# EAGLE design pla251715 (EAGLE 6.3)
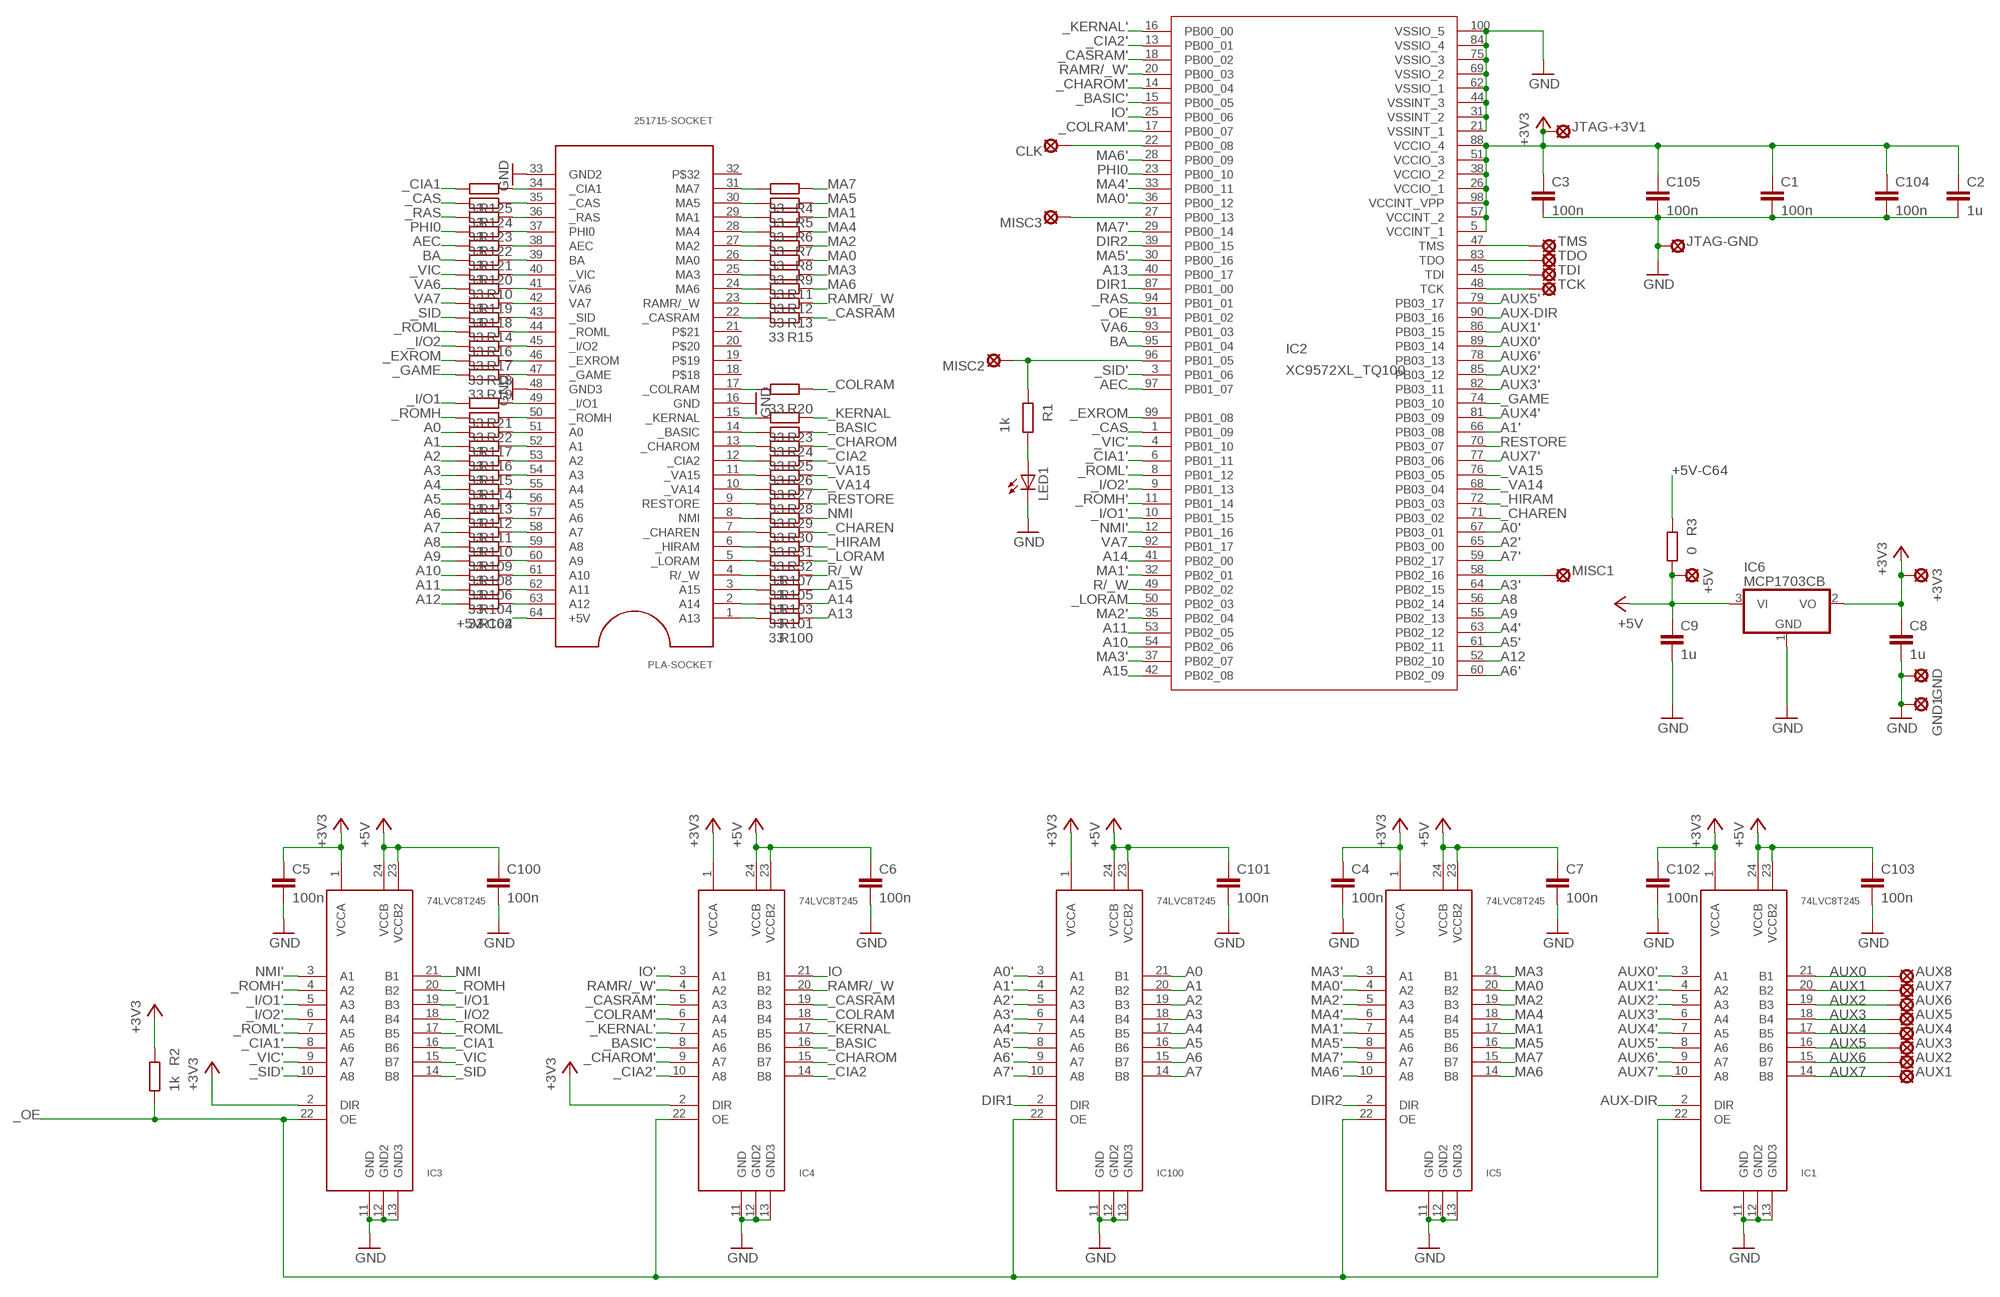
[diagram p0: schematic, sheet 1]

## Parts
+3V3  LSP10  [LSP10]
+5V  LSP10  [LSP10]
AUX1  LSP10  [LSP10]
AUX2  LSP10  [LSP10]
AUX3  LSP10  [LSP10]
AUX4  LSP10  [LSP10]
AUX5  LSP10  [LSP10]
AUX6  LSP10  [LSP10]
AUX7  LSP10  [LSP10]
AUX8  LSP10  [LSP10]
C1  100n  C-EUC0603  [C0603]
C2  1u  C-EUC1210  [C1210]
C3  100n  C-EUC0603  [C0603]
C4  100n  C-EUC0603  [C0603]
C5  100n  C-EUC0603  [C0603]
C6  100n  C-EUC0603  [C0603]
C7  100n  C-EUC0603  [C0603]
C8  1u  C-EUC1210  [C1210]
C9  1u  C-EUC1210  [C1210]
C100  100n  C-EUC0603  [C0603]
C101  100n  C-EUC0603  [C0603]
C102  100n  C-EUC0603  [C0603]
C103  100n  C-EUC0603  [C0603]
C104  100n  C-EUC0603  [C0603]
C105  100n  C-EUC0603  [C0603]
CLK  LSP10  [LSP10]
GND  LSP10  [LSP10]
GND1  LSP10  [LSP10]
IC1  74LVC8T245  [TSSOP24]
IC2  XC9572XL_TQ100  [TQ100]
IC3  74LVC8T245  [TSSOP24]
IC4  74LVC8T245  [TSSOP24]
IC5  74LVC8T245  [TSSOP24]
IC6  MCP1703CB  [SOT23]
IC100  74LVC8T245  [TSSOP24]
JTAG-+3V1  LSP10  [LSP10]
JTAG-GND  LSP10  [LSP10]
LED1  LED5MM  [LED5MM]
MISC1  LSP10  [LSP10]
MISC2  LSP10  [LSP10]
MISC3  LSP10  [LSP10]
PLA-SOCKET  251715-SOCKET  [64-SPDIP]
R1  1k  R-EU_R0805  [R0805]
R2  1k  R-EU_R0805  [R0805]
R3  0  R-EU_R0805  [R0805]
R4  33  R-EU_R0402  [R0402]
R5  33  R-EU_R0402  [R0402]
R6  33  R-EU_R0402  [R0402]
R7  33  R-EU_R0402  [R0402]
R8  33  R-EU_R0402  [R0402]
R9  33  R-EU_R0402  [R0402]
R10  33  R-EU_R0402  [R0402]
R11  33  R-EU_R0402  [R0402]
R12  33  R-EU_R0402  [R0402]
R13  33  R-EU_R0402  [R0402]
R14  33  R-EU_R0402  [R0402]
R15  33  R-EU_R0402  [R0402]
R16  33  R-EU_R0402  [R0402]
R17  33  R-EU_R0402  [R0402]
R18  33  R-EU_R0402  [R0402]
R19  33  R-EU_R0402  [R0402]
R20  33  R-EU_R0402  [R0402]
R21  33  R-EU_R0402  [R0402]
R22  33  R-EU_R0402  [R0402]
R23  33  R-EU_R0402  [R0402]
R24  33  R-EU_R0402  [R0402]
R25  33  R-EU_R0402  [R0402]
R26  33  R-EU_R0402  [R0402]
R27  33  R-EU_R0402  [R0402]
R28  33  R-EU_R0402  [R0402]
R29  33  R-EU_R0402  [R0402]
R30  33  R-EU_R0402  [R0402]
R31  33  R-EU_R0402  [R0402]
R32  33  R-EU_R0402  [R0402]
R100  33  R-EU_R0402  [R0402]
R101  33  R-EU_R0402  [R0402]
R102  33  R-EU_R0402  [R0402]
R103  33  R-EU_R0402  [R0402]
R104  33  R-EU_R0402  [R0402]
R105  33  R-EU_R0402  [R0402]
R106  33  R-EU_R0402  [R0402]
R107  33  R-EU_R0402  [R0402]
R108  33  R-EU_R0402  [R0402]
R109  33  R-EU_R0402  [R0402]
R110  33  R-EU_R0402  [R0402]
R111  33  R-EU_R0402  [R0402]
R112  33  R-EU_R0402  [R0402]
R113  33  R-EU_R0402  [R0402]
R114  33  R-EU_R0402  [R0402]
R115  33  R-EU_R0402  [R0402]
R116  33  R-EU_R0402  [R0402]
R117  33  R-EU_R0402  [R0402]
R118  33  R-EU_R0402  [R0402]
R119  33  R-EU_R0402  [R0402]
R120  33  R-EU_R0402  [R0402]
R121  33  R-EU_R0402  [R0402]
R122  33  R-EU_R0402  [R0402]
R123  33  R-EU_R0402  [R0402]
R124  33  R-EU_R0402  [R0402]
R125  33  R-EU_R0402  [R0402]
TCK  LSP10  [LSP10]
TDI  LSP10  [LSP10]
TDO  LSP10  [LSP10]
TMS  LSP10  [LSP10]

## Nets
+3V3: +3V3.MP C1.1 C2.1 C3.1 C4.1 C5.1 C8.1 C102.1 C104.1 C105.1 IC1.1(VCCA) IC2.5(VCCINT_1) IC2.26(VCCIO_1) IC2.38(VCCIO_2) IC2.51(VCCIO_3) IC2.57(VCCINT_2) IC2.88(VCCIO_4) IC2.98(VCCINT_VPP) IC3.1(VCCA) IC3.2(DIR) IC4.1(VCCA) IC4.2(DIR) IC5.1(VCCA) IC6.2(VO) IC100.1(VCCA) JTAG-+3V1.MP R2.1
+5V: +5V.MP C6.1 C7.1 C9.1 C100.1 C101.1 C103.1 IC1.23(VCCB2) IC1.24(VCCB) IC3.23(VCCB2) IC3.24(VCCB) IC4.23(VCCB2) IC4.24(VCCB) IC5.23(VCCB2) IC5.24(VCCB) IC6.3(VI) IC100.23(VCCB2) IC100.24(VCCB) R3.2
+5V-C64: PLA-SOCKET.64(+5V) R3.1
_BASIC: IC4.16(B6) R24.1
_BASIC': IC2.15(PB00_05) IC4.8(A6)
_CAS: IC2.1(PB01_09) R124.2
_CASRAM: IC4.19(B3) R15.1
_CASRAM': IC2.18(PB00_02) IC4.5(A3)
_CHAREN: IC2.71(PB03_02) R31.1
_CHAROM: IC4.15(B7) R25.1
_CHAROM': IC2.14(PB00_04) IC4.9(A7)
_CIA1: IC3.16(B6) R125.2
_CIA1': IC2.6(PB01_11) IC3.8(A6)
_CIA2: IC4.14(B8) R26.1
_CIA2': IC2.13(PB00_01) IC4.10(A8)
_COLRAM: IC4.18(B4) R20.1
_COLRAM': IC2.17(PB00_07) IC4.6(A4)
_EXROM: IC2.99(PB01_08) R18.2
_GAME: IC2.74(PB03_10) R19.2
_HIRAM: IC2.72(PB03_03) R32.1
_I/O1: IC3.19(B3) R21.2
_I/O1': IC2.10(PB01_15) IC3.5(A3)
_I/O2: IC3.18(B4) R17.2
_I/O2': IC2.9(PB01_13) IC3.6(A4)
_KERNAL: IC4.17(B5) R23.1
_KERNAL': IC2.16(PB00_00) IC4.7(A5)
_LORAM: IC2.50(PB02_03) R107.1
_OE: IC1.22(OE) IC2.91(PB01_02) IC3.22(OE) IC4.22(OE) IC5.22(OE) IC100.22(OE) R2.2
_RAS: IC2.94(PB01_01) R123.2
_ROMH: IC3.20(B2) R22.2
_ROMH': IC2.11(PB01_14) IC3.4(A2)
_ROML: IC3.17(B5) R16.2
_ROML': IC2.8(PB01_12) IC3.7(A5)
_SID: IC3.14(B8) R14.2
_SID': IC2.3(PB01_06) IC3.10(A8)
_VA14: IC2.68(PB03_04) R28.1
_VA15: IC2.76(PB03_05) R27.1
_VIC: IC3.15(B7) R10.2
_VIC': IC2.4(PB01_10) IC3.9(A7)
A0: IC100.21(B1) R117.2
A0': IC2.67(PB03_01) IC100.3(A1)
A1: IC100.20(B2) R116.2
A1': IC2.66(PB03_08) IC100.4(A2)
A2: IC100.19(B3) R115.2
A2': IC2.65(PB03_00) IC100.5(A3)
A3: IC100.18(B4) R114.2
A3': IC2.64(PB02_15) IC100.6(A4)
A4: IC100.17(B5) R113.2
A4': IC2.63(PB02_12) IC100.7(A5)
A5: IC100.16(B6) R112.2
A5': IC2.61(PB02_11) IC100.8(A6)
A6: IC100.15(B7) R111.2
A6': IC2.60(PB02_09) IC100.9(A7)
A7: IC100.14(B8) R110.2
A7': IC2.59(PB02_17) IC100.10(A8)
A8: IC2.56(PB02_14) R109.2
A9: IC2.55(PB02_13) R108.2
A10: IC2.54(PB02_06) R106.2
A11: IC2.53(PB02_05) R104.2
A12: IC2.52(PB02_10) R102.2
A13: IC2.40(PB00_17) R100.1
A14: IC2.41(PB02_00) R101.1
A15: IC2.42(PB02_08) R103.1
AEC: IC2.97(PB01_07) R121.2
AUX0: AUX8.MP IC1.21(B1)
AUX0': IC1.3(A1) IC2.89(PB03_14)
AUX1: AUX7.MP IC1.20(B2)
AUX1': IC1.4(A2) IC2.86(PB03_15)
AUX2: AUX6.MP IC1.19(B3)
AUX2': IC1.5(A3) IC2.85(PB03_12)
AUX3: AUX5.MP IC1.18(B4)
AUX3': IC1.6(A4) IC2.82(PB03_11)
AUX4: AUX4.MP IC1.17(B5)
AUX4': IC1.7(A5) IC2.81(PB03_09)
AUX5: AUX3.MP IC1.16(B6)
AUX5': IC1.8(A6) IC2.79(PB03_17)
AUX6: AUX2.MP IC1.15(B7)
AUX6': IC1.9(A7) IC2.78(PB03_13)
AUX7: AUX1.MP IC1.14(B8)
AUX7': IC1.10(A8) IC2.77(PB03_06)
AUX-DIR: IC1.2(DIR) IC2.90(PB03_16)
BA: IC2.95(PB01_04) R120.2
DIR1: IC2.87(PB01_00) IC100.2(DIR)
DIR2: IC2.39(PB00_15) IC5.2(DIR)
GND: C1.2 C2.2 C3.2 C4.2 C5.2 C6.2 C7.2 C8.2 C9.2 C100.2 C101.2 C102.2 C103.2 C104.2 C105.2 GND1.MP GND.MP IC1.11(GND) IC1.12(GND2) IC1.13(GND3) IC2.21(VSSINT_1) IC2.31(VSSINT_2) IC2.44(VSSINT_3) IC2.62(VSSIO_1) IC2.69(VSSIO_2) IC2.75(VSSIO_3) IC2.84(VSSIO_4) IC2.100(VSSIO_5) IC3.11(GND) IC3.12(GND2) IC3.13(GND3) IC4.11(GND) IC4.12(GND2) IC4.13(GND3) IC5.11(GND) IC5.12(GND2) IC5.13(GND3) IC6.1(GND) IC100.11(GND) IC100.12(GND2) IC100.13(GND3) JTAG-GND.MP LED1.K(C) PLA-SOCKET.16(GND) PLA-SOCKET.33(GND2) PLA-SOCKET.48(GND3)
IO: IC4.21(B1)
IO': IC2.25(PB00_06) IC4.3(A1)
MA0: IC5.20(B2) R9.1
MA0': IC2.36(PB00_12) IC5.4(A2)
MA1: IC5.17(B5) R6.1
MA1': IC2.32(PB02_01) IC5.7(A5)
MA2: IC5.19(B3) R8.1
MA2': IC2.35(PB02_04) IC5.5(A3)
MA3: IC5.21(B1) R11.1
MA3': IC2.37(PB02_07) IC5.3(A1)
MA4: IC5.18(B4) R7.1
MA4': IC2.33(PB00_11) IC5.6(A4)
MA5: IC5.16(B6) R5.1
MA5': IC2.30(PB00_16) IC5.8(A6)
MA6: IC5.14(B8) R12.1
MA6': IC2.28(PB00_09) IC5.10(A8)
MA7: IC5.15(B7) R4.1
MA7': IC2.29(PB00_14) IC5.9(A7)
N$1: IC2.96(PB01_05) MISC2.MP R1.1
N$2: IC2.58(PB02_16) MISC1.MP
N$3: IC2.27(PB00_13) MISC3.MP
N$4: LED1.A R1.2
N$22: CLK.MP IC2.22(PB00_08)
N$26: PLA-SOCKET.17(_COLRAM) R20.2
N$27: PLA-SOCKET.31(MA7) R4.2
N$28: PLA-SOCKET.30(MA5) R5.2
N$29: PLA-SOCKET.15(_KERNAL) R23.2
N$30: PLA-SOCKET.29(MA1) R6.2
N$31: PLA-SOCKET.28(MA4) R7.2
N$32: PLA-SOCKET.27(MA2) R8.2
N$33: PLA-SOCKET.26(MA0) R9.2
N$34: PLA-SOCKET.25(MA3) R11.2
N$35: PLA-SOCKET.24(MA6) R12.2
N$36: PLA-SOCKET.23(RAMR/_W) R13.2
N$37: PLA-SOCKET.22(_CASRAM) R15.2
N$38: PLA-SOCKET.14(_BASIC) R24.2
N$39: PLA-SOCKET.13(_CHAROM) R25.2
N$40: PLA-SOCKET.12(_CIA2) R26.2
N$41: PLA-SOCKET.11(_VA15) R27.2
N$42: PLA-SOCKET.10(_VA14) R28.2
N$43: PLA-SOCKET.9(RESTORE) R29.2
N$44: PLA-SOCKET.8(NMI) R30.2
N$45: PLA-SOCKET.7(_CHAREN) R31.2
N$46: PLA-SOCKET.6(_HIRAM) R32.2
N$47: PLA-SOCKET.5(_LORAM) R107.2
N$48: PLA-SOCKET.4(R/_W) R105.2
N$49: PLA-SOCKET.3(A15) R103.2
N$50: PLA-SOCKET.2(A14) R101.2
N$51: PLA-SOCKET.1(A13) R100.2
N$52: PLA-SOCKET.63(A12) R102.1
N$53: PLA-SOCKET.62(A11) R104.1
N$54: PLA-SOCKET.61(A10) R106.1
N$55: PLA-SOCKET.60(A9) R108.1
N$56: PLA-SOCKET.59(A8) R109.1
N$57: PLA-SOCKET.58(A7) R110.1
N$58: PLA-SOCKET.57(A6) R111.1
N$59: PLA-SOCKET.56(A5) R112.1
N$60: PLA-SOCKET.55(A4) R113.1
N$61: PLA-SOCKET.54(A3) R114.1
N$62: PLA-SOCKET.53(A2) R115.1
N$63: PLA-SOCKET.52(A1) R116.1
N$64: PLA-SOCKET.51(A0) R117.1
N$65: PLA-SOCKET.50(_ROMH) R22.1
N$66: PLA-SOCKET.49(_I/O1) R21.1
N$67: PLA-SOCKET.47(_GAME) R19.1
N$68: PLA-SOCKET.46(_EXROM) R18.1
N$69: PLA-SOCKET.45(_I/O2) R17.1
N$70: PLA-SOCKET.44(_ROML) R16.1
N$71: PLA-SOCKET.43(_SID) R14.1
N$72: PLA-SOCKET.42(VA7) R118.1
N$73: PLA-SOCKET.41(VA6) R119.1
N$74: PLA-SOCKET.40(_VIC) R10.1
N$75: PLA-SOCKET.39(BA) R120.1
N$76: PLA-SOCKET.38(AEC) R121.1
N$77: PLA-SOCKET.37(PHI0) R122.1
N$78: PLA-SOCKET.36(_RAS) R123.1
N$79: PLA-SOCKET.35(_CAS) R124.1
N$80: PLA-SOCKET.34(_CIA1) R125.1
NMI: IC3.21(B1) R30.1
NMI': IC2.12(PB01_16) IC3.3(A1)
PHI0: IC2.23(PB00_10) R122.2
R/_W: IC2.49(PB02_02) R105.1
RAMR/_W: IC4.20(B2) R13.1
RAMR/_W': IC2.20(PB00_03) IC4.4(A2)
RESTORE: IC2.70(PB03_07) R29.1
TCK: IC2.48(TCK) TCK.MP
TDI: IC2.45(TDI) TDI.MP
TDO: IC2.83(TDO) TDO.MP
TMS: IC2.47(TMS) TMS.MP
VA6: IC2.93(PB01_03) R119.2
VA7: IC2.92(PB01_17) R118.2
Unconnected: PLA-SOCKET.18 PLA-SOCKET.19 PLA-SOCKET.20 PLA-SOCKET.21 PLA-SOCKET.32

## Library data of the parts
+3V3 +5V AUX1-AUX8 CLK GND GND1 JTAG-+3V1 JTAG-GND MISC1-MISC3 TCK TDI TDO TMS = solpad:LSP10: SOLDER PAD drill 1.0 mm, distributor Buerklin, 12H555
C1-C9 C100-C105 = rcl:C-EU: CAPACITOR, European symbol
IC1 IC3-IC5 IC100 = 74lvc8t245:74LVC8T245
IC2 = xc9572xl-tq100:XC9572XL_TQ100
IC6 = linear:MCP1703: 250 mA, 16V, Low Quiescent Current LDO Regulator Source: http://ww1.microchip.com/downloads/en/DeviceDoc/22049b.pdf
LED1 = led:LED: LED OSRAM: - CHIPLED LG R971, LG N971, LY N971, LG Q971, LY Q971, LO R971, LY R971 LH N974, LH R974 LS Q976, LO Q976, LY Q976 LO Q996 - Hyper CHIPLED LW Q18S LB Q993, LB Q99A, LB R99A - SideLED LS A670, LO A670, LY A670, LG A670, LP A670 LB A673, LV A673, LT A673, LW A673 LH A674 LY A675 LS A676, LA A676, LO A676, LY A676, LW A676 LS A679, LY A679, LG A679 - Hyper Micro SIDELED® LS Y876, LA Y876, LO Y876, LY Y876 LT Y87S - SmartLED LW L88C, LW L88S LB L89C, LB L89S, LG L890 LS L89K, LO L89K, LY L89K LS L896, LA L896, LO L896, LY L896 - TOPLED LS T670, LO T670, LY T670, LG T670, LP T670 LSG T670, LSP T670, LSY T670, LOP T670, LYG T670 LG T671, LOG T671, LSG T671 LB T673, LV T673, LT T673, LW T673 LH T674 LS T676, LA T676, LO T676, LY T676, LB T676, LH T676, LSB T676, LW T676 LB T67C, LV T67C, LT T67C, LS T67K, LO T67K, LY T67K, LW E67C LS E67B, LA E67B, LO E67B, LY E67B, LB E67C, LV E67C, LT E67C LW T67C LS T679, LY T679, LG T679 LS T770, LO T770, LY T770, LG T770, LP T770 LB T773, LV T773, LT T773, LW T773 LH T774 LS E675, LA E675, LY E675, LS T675 LS T776, LA T776, LO T776, LY T776, LB T776 LHGB T686 LT T68C, LB T68C - Hyper Mini TOPLED® LB M676 - Mini TOPLED Santana® LG M470 LS M47K, LO M47K, LY M47K Source: http://www.osram.convergy.de LUXEON: - LUMILED® LXK2-PW12-R00, LXK2-PW12-S00, LXK2-PW14-U00, LXK2-PW14-V00 LXK2-PM12-R00, LXK2-PM12-S00, LXK2-PM14-U00 LXK2-PE12-Q00, LXK2-PE12-R00, LXK2-PE12-S00, LXK2-PE14-T00, LXK2-PE14-U00 LXK2-PB12-K00, LXK2-PB12-L00, LXK2-PB12-M00, LXK2-PB14-N00, LXK2-PB14-P00, LXK2-PB14-Q00 LXK2-PR12-L00, LXK2-PR12-M00, LXK2-PR14-Q00, LXK2-PR14-R00 LXK2-PD12-Q00, LXK2-PD12-R00, LXK2-PD12-S00 LXK2-PH12-R00, LXK2-PH12-S00 LXK2-PL12-P00, LXK2-PL12-Q00, LXK2-PL12-R00 Source: www.luxeon.com KINGBRIGHT: KA-3528ASYC Source: www.kingbright.com
PLA-SOCKET = 251715-socket:251715-SOCKET
R1-R32 R100-R125 = rcl:R-EU_: RESISTOR, European symbol

## Board
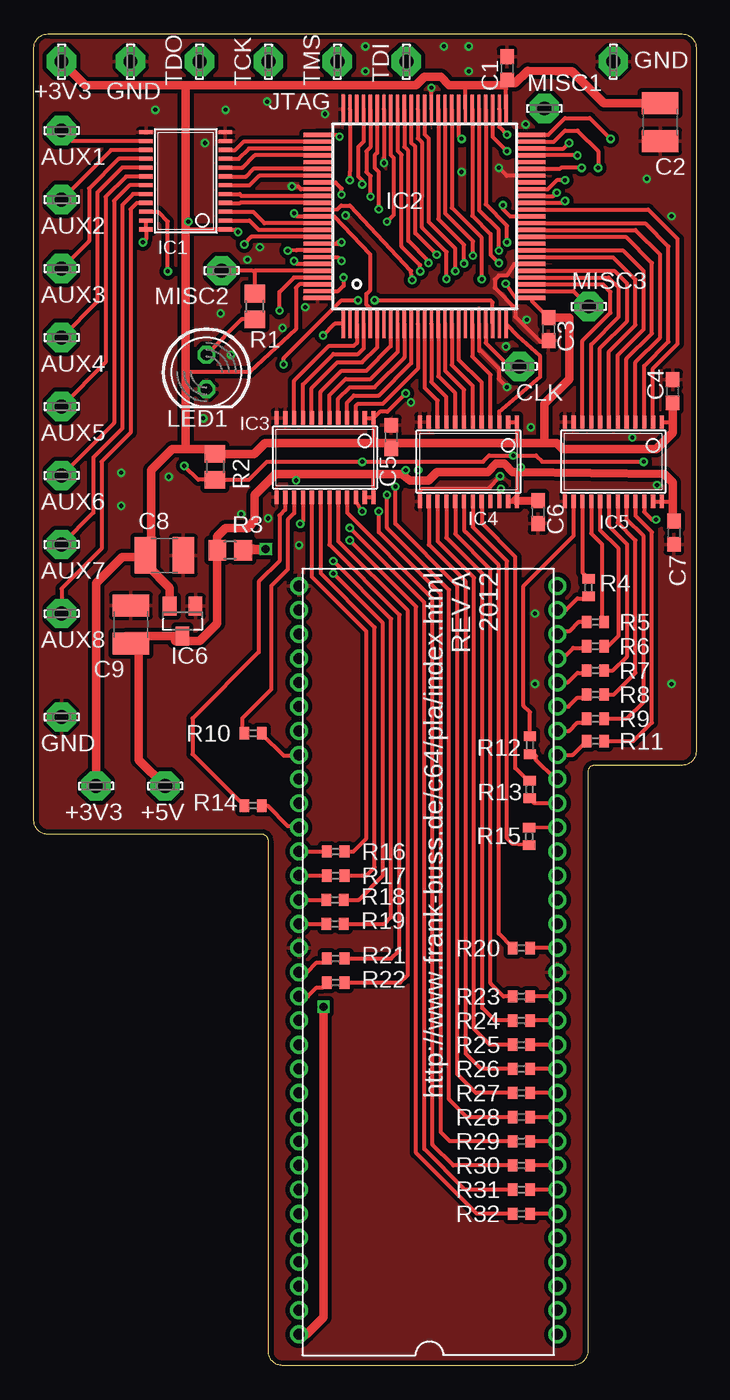
[diagram p1: board, top side]
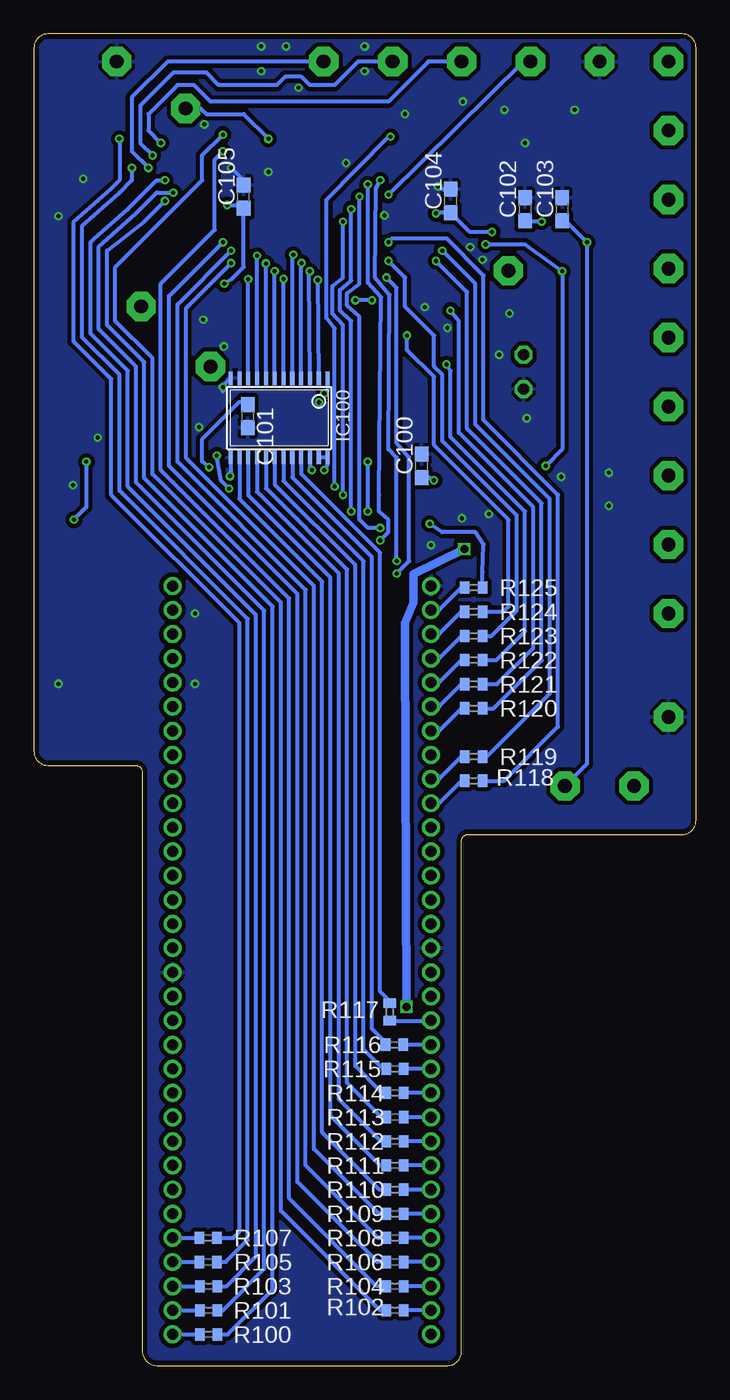
[diagram p2: board, bottom side, seen from below]

Size 48.77 x 98.05 mm. Coordinates in mm from the lower left corner, seen from the top.
Outline: 0,97.03 arc-90 1.02,98.05 47.75,98.05 arc-90 48.77,97.03 48.77,45.21 arc-90 47.75,44.2 41.3,44.2 arc90 40.79,43.69 40.79,1.02 arc-90 39.62,0 18.29,0 arc-90 17.27,1.02 17.27,38.61 arc90 16.76,39.12 1.02,39.12 arc-90 0,40.13 0,97.03
Copper layers (1*16): Top 0.035mm / dielectric 1.5mm / Bottom 0.035mm
Design rules "ITead_rule": minimum track width 6mil, minimum drill 12mil, track to track 6mil, track to pad 6mil, pad to pad 6mil, via to via 6mil, smd to smd 0mil, copper to edge 10mil, drill to drill 10mil, minimum pad ring 10mil, minimum via ring 6mil, stop-mask expansion 2mil, vias tented up to drill 100mil, thermal gap 10mil

### Footprints (pad centres in the part's own frame; a part is rotated, then mirrored left to right if it is on the bottom)
LSP10 = drill 1.016 pad 2.159 octagon: MP 0,0
C0603 = smd 1.1 x 1: 1 -0.85,0; 2 0.85,0
C1210 = smd 1.6 x 2.7: 1 -1.4,0; 2 1.4,0
TSSOP24 = smd 0.305 x 0.991: 1 -3.575,-2.918; 2 -2.925,-2.918; 3 -2.275,-2.918; 4 -1.625,-2.918; 5 -0.975,-2.918; 6 -0.325,-2.918; 7 0.325,-2.918; 8 0.975,-2.918; 9 1.625,-2.918; 10 2.275,-2.918; 11 2.925,-2.918; 12 3.575,-2.918; 13 3.575,2.918; 14 2.925,2.918; 15 2.275,2.918; 16 1.625,2.918; 17 0.975,2.918; 18 0.325,2.918; 19 -0.325,2.918; 20 -0.975,2.918; 21 -1.625,2.918; 22 -2.275,2.918; 23 -2.925,2.918; 24 -3.575,2.918
TQ100 = smd 0.254 x 2.032: 1 -6,-7.9; 2 -5.5,-7.9; 3 -5,-7.9; 4 -4.5,-7.9; 5 -4,-7.9; 6 -3.5,-7.9; 7 -3,-7.9; 8 -2.5,-7.9; 9 -2,-7.9; 10 -1.5,-7.9; 11 -1,-7.9; 12 -0.5,-7.9; 13 0,-7.9; 14 0.5,-7.9; 15 1,-7.9; 16 1.5,-7.9; 17 2,-7.9; 18 2.5,-7.9; 19 3,-7.9; 20 3.5,-7.9; 21 4,-7.9; 22 4.5,-7.9; 23 5,-7.9; 24 5.5,-7.9; 25 6,-7.9; 51 6,7.9; 52 5.5,7.9; 53 5,7.9; 54 4.5,7.9; 55 4,7.9; 56 3.5,7.9; 57 3,7.9; 58 2.5,7.9; 59 2,7.9; 60 1.5,7.9; 61 1,7.9; 62 0.5,7.9; 63 0,7.9; 64 -0.5,7.9; 65 -1,7.9; 66 -1.5,7.9; 67 -2,7.9; 68 -2.5,7.9; 69 -3,7.9; 70 -3.5,7.9; 71 -4,7.9; 72 -4.5,7.9; 73 -5,7.9; 74 -5.5,7.9; 75 -6,7.9 | smd 2.032 x 0.254: 26 7.9,-6; 27 7.9,-5.5; 28 7.9,-5; 29 7.9,-4.5; 30 7.9,-4; 31 7.9,-3.5; 32 7.9,-3; 33 7.9,-2.5; 34 7.9,-2; 35 7.9,-1.5; 36 7.9,-1; 37 7.9,-0.5; 38 7.9,0; 39 7.9,0.5; 40 7.9,1; 41 7.9,1.5; 42 7.9,2; 43 7.9,2.5; 44 7.9,3; 45 7.9,3.5; 46 7.9,4; 47 7.9,4.5; 48 7.9,5; 49 7.9,5.5; 50 7.9,6; 76 -7.9,6; 77 -7.9,5.5; 78 -7.9,5; 79 -7.9,4.5; 80 -7.9,4; 81 -7.9,3.5; 82 -7.9,3; 83 -7.9,2.5; 84 -7.9,2; 85 -7.9,1.5; 86 -7.9,1; 87 -7.9,0.5; 88 -7.9,0; 89 -7.9,-0.5; 90 -7.9,-1; 91 -7.9,-1.5; 92 -7.9,-2; 93 -7.9,-2.5; 94 -7.9,-3; 95 -7.9,-3.5; 96 -7.9,-4; 97 -7.9,-4.5; 98 -7.9,-5; 99 -7.9,-5.5; 100 -7.9,-6
SOT23 = smd 1 x 1.4: 1 -0.95,-1.1; 2 0.95,-1.1; 3 0,1.1
LED5MM = drill 0.813 octagon: A -1.27,0; K 1.27,0
64-SPDIP = drill 0.813: 1 -28.956,-10.668; 2 -27.178,-10.668; 3 -25.4,-10.668; 4 -23.622,-10.668; 5 -21.844,-10.668; 6 -20.066,-10.668; 7 -18.288,-10.668; 8 -16.51,-10.668; 9 -14.732,-10.668; 10 -12.954,-10.668; 11 -11.176,-10.668; 12 -9.398,-10.668; 13 -7.62,-10.668; 14 -5.842,-10.668; 15 -4.064,-10.668; 16 -2.286,-10.668; 17 -0.508,-10.668; 18 1.27,-10.668; 19 3.048,-10.668; 20 4.826,-10.668; 21 6.604,-10.668; 22 8.382,-10.668; 23 10.16,-10.668; 24 11.938,-10.668; 25 13.716,-10.668; 26 15.494,-10.668; 27 17.272,-10.668; 28 19.05,-10.668; 29 20.828,-10.668; 30 22.606,-10.668; 31 24.384,-10.668; 32 26.162,-10.668; 33 26.162,8.382; 34 24.384,8.382; 35 22.606,8.382; 36 20.828,8.382; 37 19.05,8.382; 38 17.272,8.382; 39 15.494,8.382; 40 13.716,8.382; 41 11.938,8.382; 42 10.16,8.382; 43 8.382,8.382; 44 6.604,8.382; 45 4.826,8.382; 46 3.048,8.382; 47 1.27,8.382; 48 -0.508,8.382; 49 -2.286,8.382; 50 -4.064,8.382; 51 -5.842,8.382; 52 -7.62,8.382; 53 -9.398,8.382; 54 -11.176,8.382; 55 -12.954,8.382; 56 -14.732,8.382; 57 -16.51,8.382; 58 -18.288,8.382; 59 -20.066,8.382; 60 -21.844,8.382; 61 -23.622,8.382; 62 -25.4,8.382; 63 -27.178,8.382; 64 -28.956,8.382
R0805 = smd 1.3 x 1.5: 1 -0.95,0; 2 0.95,0
R0402 = smd 0.7 x 0.9: 1 -0.65,0; 2 0.65,0

### Placement (x,y rotation side)
+3V3  4.57,42.67 0 top
+5V  9.65,42.67 0 top
AUX1  2.03,90.93 0 top
AUX2  2.03,85.85 0 top
AUX3  2.03,80.77 0 top
AUX4  2.03,75.69 0 top
AUX5  2.03,70.61 0 top
AUX6  2.03,65.53 0 top
AUX7  2.03,60.45 0 top
AUX8  2.03,55.37 0 top
C1  34.85,95.51 90 top
C2  46.13,91.54 270 top
C3  37.9,76.3 270 top
C4  47.04,71.73 90 top
C5  26.31,68.38 90 top
C6  37.13,62.84 270 top
C7  47.14,61.32 270 top
C8  9.6,59.65 0 top
C9  7.14,54.57 90 top
C100  20.22,66.25 90 bottom
C101  33.02,69.9 270 bottom
C102  12.6,85.14 90 bottom
C103  9.86,85.14 90 bottom
C104  18.08,85.75 90 bottom
C105  33.32,86.06 90 bottom
CLK  35.76,73.56 0 top
GND  42.67,96.01 90 top
GND1  2.03,47.75 0 top
IC1  11.18,87.23 90 top
IC2  28.78,84.61 0 top
IC3  21.44,66.86 180 top
IC4  32,66.55 180 top
IC5  42.67,66.55 180 top
IC6  10.95,54.82 180 top
IC100  30.71,69.78 180 bottom
JTAG-+3V1  2.03,96.01 90 top
JTAG-GND  7.11,96.01 90 top
LED1  12.7,73.15 270 top
MISC1  37.59,92.56 0 top
MISC2  13.82,80.62 0 top
MISC3  40.87,77.98 0 top
PLA-SOCKET  27.89,31.24 90 top
R1  16.26,77.98 270 top
R2  13.34,66.17 270 top
R3  14.45,60.03 180 top
R4  40.85,57.28 270 top
R5  41.36,54.74 180 top
R6  41.36,52.96 180 top
R7  41.36,51.18 180 top
R8  41.36,49.41 180 top
R9  41.36,47.63 180 top
R10  16.13,46.56 180 top
R11  41.36,45.98 180 top
R12  36.53,45.67 270 top
R13  36.51,42.42 270 top
R14  16.13,41.23 180 top
R15  36.47,38.95 90 top
R16  22.23,37.85 0 top
R17  22.23,36.07 0 top
R18  22.18,34.29 0 top
R19  22.18,32.51 0 top
R20  35.9,30.74 0 top
R21  22.23,29.97 0 top
R22  22.23,28.2 0 top
R23  35.9,27.18 0 top
R24  35.9,25.4 0 top
R25  35.9,23.62 0 top
R26  35.9,21.85 0 top
R27  35.9,20.07 0 top
R28  35.9,18.29 0 top
R29  35.9,16.51 0 top
R30  35.9,14.73 0 top
R31  35.9,12.96 0 top
R32  35.9,11.18 0 top
R100  35.9,2.29 180 bottom
R101  35.9,4.07 180 bottom
R102  22.18,4.07 180 bottom
R103  35.9,5.84 180 bottom
R104  22.18,5.84 180 bottom
R105  35.94,7.62 180 bottom
R106  22.18,7.62 180 bottom
R107  35.94,9.4 180 bottom
R108  22.18,9.4 180 bottom
R109  22.18,11.18 180 bottom
R110  22.18,12.96 180 bottom
R111  22.18,14.73 180 bottom
R112  22.18,16.51 180 bottom
R113  22.18,18.29 180 bottom
R114  22.18,20.07 180 bottom
R115  22.18,21.85 180 bottom
R116  22.23,23.62 180 bottom
R117  22.56,26.04 90 bottom
R118  16.38,43.06 0 bottom
R119  16.38,44.83 0 bottom
R120  16.38,48.39 0 bottom
R121  16.38,50.17 0 bottom
R122  16.38,51.95 0 bottom
R123  16.38,53.72 0 bottom
R124  16.38,55.5 0 bottom
R125  16.38,57.28 0 bottom
TCK  17.27,96.01 90 top
TDI  27.43,96.01 90 top
TDO  12.19,96.01 90 top
TMS  22.35,96.01 90 top

### Tracks (layer width: path | path; a pad name or v marks a point on that pad's centre or on a via)
+3V3  (via drill 0.3)
  Top 0.305: 11.21,83.65 IC1.1 14.85,83.65 v15.04,83.47 | 11.21,83.65 11.18,83.62 | 11.21,83.65 11.21,84.06 v11.38,84.23 | IC2.57 31.78,94.01 31.5,94.29 | IC2.51 34.78,93.99 34.48,94.29 | IC2.38 35.08,84.61 34.54,85.14 v34.54,85.45 | C3.1 36.68,78.37 IC2.26 35.49,78.61 v34.75,79.66 | v19.15,84.84 19.38,84.61 IC2.88 22.12,84.61 24.78,81.8 24.78,79.19 24.49,78.89 24.49,78.13 24.79,77.83 IC2.5 | IC2.98 19.56,79.61 19.3,79.35 19.3,76.3 15.9,73.15 11.07,73.15 11.18,75.08 | IC3.1 25.01,68.31 25.4,67.92 | IC3.2 IC3.1 | v27.38,71.58 26.03,70.23 25.47,70.23 IC3.1 | IC5.1 46.87,69.47 47.04,69.29 | IC4.2 IC4.1 35.58,67.95 35.61,67.92
  Top 0.61: C8.1 8.64,59.78 8.64,65.94 10.16,67.46 11.07,67.46 | 11.18,94.29 3.76,94.29 JTAG-+3V1.MP | 11.18,94.29 28.14,94.29 28.75,94.9 29.97,94.9 30.58,94.29 31.5,94.29 34.48,94.29 C1.1 35.1,94.4 35.42,94.4 36.37,95.35 38.44,95.32 39.61,95.32 41.98,92.94 C2.1 | C8.1 8.09,59.54 6.5,59.54 4.57,57.61 +3V3.MP | IC6.2 10,57.26 8.33,58.93 8.33,59.52 C8.1 | 11.07,67.46 12.99,67.46 R2.1 16.21,67.12 17.02,67.92 25.4,67.92 26.23,67.92 | 26.23,67.92 C5.1 | 26.23,67.92 35.61,67.92 37.59,67.92 | 37.59,67.92 38.51,67.92 38.96,67.46 45.82,67.46 47.04,68.68 47.04,69.29 C4.1 | C3.1 39.42,77.15 39.42,72.65 37.59,70.82 37.59,67.92 | 11.18,94.29 11.18,83.62 11.18,75.08 11.18,67.57 11.07,67.46
  Bottom 0.305: v11.38,84.23 12.53,84.23 C102.1 | v34.54,85.45 33.56,85.45 C105.1 33.32,80.88 34.24,79.96 v34.75,79.66 | v15.04,83.47 16.65,83.47 C104.1 19.09,84.9 v19.15,84.84 | 27.38,71.73 v27.38,71.58 27.13,71.83 IC100.1
+5V  (via drill 0.3)
  Top 0.305: v8.03,82.7 8.26,82.94 IC1.24 IC1.23 | IC5.23 IC5.24 46.91,63.63 47.04,63.5 | IC4.24 IC4.23 35.13,63.63 35.61,64.11 35.61,65.79 v35.86,66.14 | IC3.23 IC3.24 25.01,65.57 24.94,65.64 | v19.3,65.18 19.46,65.64 | v27.38,65.94 27.08,65.64
  Top 0.61: IC4.24 35.58,63.66 C6.1 | C7.1 47.04,62.27 47.04,63.5 47.04,65.03 46.43,65.64 35.61,65.79 35.25,65.79 34.65,66.4 34.04,66.4 33.43,65.79 29.67,65.79 29.06,65.18 27.69,65.18 27.08,65.64 24.94,65.64 19.46,65.64 17.78,65.64 16.26,64.11 16.26,62.28 15.8,61.67 14.12,61.67 13.5,61.05 R3.2 13.5,54.65 12.19,53.34 10.41,53.34 IC6.3 6.78,53.72 C9.1 7.72,52.58 7.72,44.6 +5V.MP
  Bottom 0.305: +5V.MP 8.03,44.3 v8.03,82.7 9.61,84.29 C103.1 | v35.86,66.14 36.37,66.55 36.37,68.23 33.63,70.97 33.11,70.97 C101.1 | C100.1 19.67,65.4 v19.3,65.18 | IC100.23 IC100.24 27.13,66.34 v27.38,65.94
+5V-C64  (via drill 0.6)
  Top 0.61: PLA-SOCKET.64 20.07,2.29 21.34,3.56 v21.34,26.42 | R3.1 17.19,60.03 16.15,60.15 v17.07,60.12
  Bottom 0.61: v21.34,26.42 21.44,53.44 21.44,54.66 20.83,56.19 20.83,58.3 v17.07,60.12
_BASIC
  Top 0.305: R24.1 33.93,25.4 33.02,26.32 33.02,58.32 30.38,60.96 IC4.16
_BASIC'
  Top 0.305: IC4.8 31.03,71.59 29.78,72.84 IC2.15
_CAS  (via drill 0.3)
  Top 0.305: IC2.1 22.15,76.71 v21.29,75.85
  Bottom 0.305: R124.2 14.2,55.5 13.82,55.88 13.82,62.28 19.3,67.77 19.3,72.8 21.29,74.78 v21.29,75.85
_CASRAM
  Top 0.305: R15.1 35.25,38.42 34.85,38.81 34.85,59.24 32.33,61.76 IC4.19
_CASRAM'
  Top 0.305: IC4.5 32.98,72.38 31.28,74.08 IC2.18
_CHAREN  (via drill 0.3)
  Top 0.305: R31.1 31.75,12.96 28.75,15.95 28.75,56.19 v23.27,61.67 | v24.79,86.06 24.79,87.58 24.49,87.89 24.49,89.41 24.78,89.7 IC2.71
  Bottom 0.305: v23.27,61.67 24.18,61.67 24.79,62.28 24.79,77.22 25.71,78.06 25.71,78.97 24.79,79.66 v24.79,86.06
_CHAROM
  Top 0.305: R25.1 33.58,23.62 32.41,24.79 32.41,58.02 29.73,60.7 IC4.15
_CHAROM'
  Top 0.305: IC4.9 30.38,71.33 29.28,72.43 IC2.14
_CIA1  (via drill 0.3)
  Top 0.305: IC3.16 19.81,62.18 v19.61,61.98
  Bottom 0.305: R125.2 15.73,58.41 15.65,60.45 16.26,61.37 18.69,61.37 v19.61,61.98
_CIA1'
  Top 0.305: IC3.8 20.46,71.98 22.35,73.87 24.18,73.87 25.28,74.96 IC2.6
_CIA2
  Top 0.305: R26.1 32.92,21.85 31.8,22.96 31.8,57.71 29.08,60.43 IC4.14
_CIA2'
  Top 0.305: IC4.10 29.73,71.06 28.78,72.01 IC2.13
_COLRAM
  Top 0.305: R20.1 35.25,30.8 34.24,31.8 34.24,58.93 32.26,60.91 31.8,61.37 31.68,61.49 IC4.18
_COLRAM'
  Top 0.305: IC4.6 32.33,72.12 30.78,73.67 IC2.17
_EXROM  (via drill 0.3)
  Top 0.305: R18.2 23.93,34.29 25.71,36.07 25.71,54.66 v22.05,58.32 | v22.81,80.11 22.81,79.5 22.41,79.11 IC2.99
  Bottom 0.305: v22.05,58.32 21.13,59.24 21.13,66.86 22.05,67.92 22.05,79.35 v22.81,80.11
_GAME  (via drill 0.3)
  Top 0.305: R19.2 25.81,32.51 26.31,33.02 26.31,54.97 v22.05,59.24 | v23.27,87.28 23.27,87.58 23.28,87.9 IC2.74
  Bottom 0.305: v22.05,59.24 22.05,66.86 22.66,67.46 22.58,78.82 23.65,80.11 23.57,86.67 v23.27,87.28
_HIRAM  (via drill 0.3)
  Top 0.305: R32.1 32.61,11.18 28.14,15.65 28.14,55.88 v23.27,60.76 | v24.18,86.97 24.18,87.28 23.88,87.58 23.88,89.72 24.28,90.12 IC2.72
  Bottom 0.305: v23.27,60.76 22.66,61.37 22.66,62.28 23.34,62.89 23.34,64.11 23.19,78.67 24.18,79.73 v24.18,86.97
_I/O1
  Top 0.305: R21.2 26.31,29.97 26.92,30.58 26.92,55.27 21.76,60.43 IC3.19
_I/O1'
  Top 0.305: IC3.5 22.41,71.18 23.27,72.04 25.1,72.04 27.28,74.22 IC2.10
_I/O2
  Top 0.305: R17.2 24.49,36.07 25.1,36.68 25.1,54.36 21.11,58.34 IC3.18
_I/O2'
  Top 0.305: IC3.6 21.76,71.45 22.96,72.65 24.79,72.65 26.78,74.63 IC2.9
_KERNAL
  Top 0.305: R23.1 34.59,27.18 33.63,28.15 33.63,58.63 31.03,61.23 IC4.17
_KERNAL'
  Top 0.305: IC4.7 31.68,71.85 30.28,73.25 IC2.16
_LORAM  (via drill 0.3)
  Top 0.305: v42.47,90.32 40.95,91.85 39.12,91.85 37.88,90.61 IC2.50
  Bottom 0.305: R107.1 34.09,9.4 33.63,9.86 33.63,54.66 43.08,64.11 43.08,72.65 45.82,75.39 45.82,84.23 43.08,86.67 42.47,87.28 v42.47,90.32
_OE  (via drill 0.3)
  Top 0.305: 28.3,66.55 v24.18,66.55 17.17,66.55 15.84,65.22 R2.2 | 28.3,66.55 33.07,66.55 33.53,67.01 v35.31,67.01 36.98,67.01 37.44,66.55 v44.91,66.55 | v45.82,62.28 45.52,62.28 44.95,62.85 IC5.22 | IC3.22 23.71,63.67 v24.18,62.89 | IC4.22 34.28,64.46 v34.39,64.57 | 13.14,65.03 R2.2 | v9.86,80.57 9.86,84.23 9.13,84.95 IC1.22 | IC2.91 16,83.11 v15.49,82.55 | v11.07,66.25 12.1,65.22 R2.2 | v28.3,65.94 28.3,66.55
  Bottom 0.305: v44.91,66.55 44.91,63.2 v45.82,62.28 | v24.18,62.89 v24.18,66.55 | v34.39,64.57 35,65.18 v35.31,67.01 | v11.07,66.25 9.86,67.46 v9.86,80.57 12.6,82.55 v15.49,82.55 | IC100.22 28.43,66.11 28.45,66.09 28.45,65.94 v28.3,65.94
_RAS  (via drill 0.3)
  Top 0.305: 22.5,81.49 v22.66,81.33 22.38,81.61 IC2.94
  Bottom 0.305: R123.2 15.06,53.72 13.21,55.58 13.21,62.59 18.69,68.07 18.69,72.95 19.3,73.56 19.3,75.85 21.44,77.98 21.44,80.11 v22.66,81.33
_ROMH
  Top 0.305: R22.2 26.98,28.2 27.53,28.76 27.53,55.58 22.41,60.7 IC3.20
_ROMH'
  Top 0.305: IC3.4 23.06,70.92 23.57,71.43 25.4,71.43 27.78,73.81 IC2.11
_ROML
  Top 0.305: R16.2 23.52,37.85 24.49,38.81 24.49,54.05 20.46,58.08 IC3.17
_ROML'
  Top 0.305: IC3.7 21.11,71.71 22.66,73.26 24.49,73.26 26.28,75.05 IC2.8
_SID
  Top 0.305: IC3.14 18.51,63.02 18.09,62.59 18.09,59.24 16.56,57.71 16.56,52.53 11.68,47.65 11.68,45.02 R14.2
_SID'
  Top 0.305: IC3.10 19.16,72.51 21.74,75.08 23.57,75.08 23.78,75.29 IC2.3
_VA14  (via drill 0.3)
  Top 0.305: R28.1 31.9,18.29 30.58,19.61 30.58,57.1 26.01,61.67 v26.01,64.11 | IC2.68 26.28,89.14 26.49,88.93 26.49,84.71 v26.01,84.23
  Bottom 0.305: v26.01,84.23 26.01,80.11 26.77,79.5 26.77,77.45 26.01,76.61 v26.01,64.11
_VA15  (via drill 0.3)
  Top 0.305: R27.1 32.56,20.07 31.19,21.44 31.19,57.41 26.62,61.98 v26.62,64.72 | IC2.76 22.37,90.61 v22.5,90.48
  Bottom 0.305: v26.62,64.72 26.62,76.38 27.23,77.14 27.23,85.83 22.66,90.48 v22.5,90.48
_VIC
  Top 0.305: IC3.15 19.16,62.75 18.69,62.28 18.69,58.63 17.48,57.41 17.48,49.79 15.34,47.65 15.34,46.7 R10.2
_VIC'
  Top 0.305: IC3.9 19.81,72.24 22.05,74.48 23.88,74.48 24.28,74.88 IC2.4
A0
  Bottom 0.305: R117.2 22.56,26.83 23.27,27.54 23.27,59.84 29.08,65.66 IC100.21
A0'  (via drill 0.3)
  Top 0.305: v28.45,80.57 28.45,81.03 27.08,82.39 27.08,89.15 26.78,89.45 IC2.67
  Bottom 0.305: IC100.3 28.51,80.25 v28.45,80.57
A1
  Bottom 0.305: R116.2 22.88,23.79 23.88,24.79 23.88,59.54 29.73,65.4 IC100.20
A1'  (via drill 0.3)
  Top 0.305: v29.06,81.18 29.06,81.33 27.58,82.81 27.58,89.44 27.28,89.74 IC2.66
  Bottom 0.305: IC100.4 29.08,80.85 v29.06,81.18
A2
  Bottom 0.305: R115.2 23.06,21.85 24.49,23.27 24.49,59.24 30.38,65.13 IC100.19
A2'  (via drill 0.3)
  Top 0.305: v29.67,81.79 28.08,83.37 28.08,89.75 27.78,90.05 IC2.65
  Bottom 0.305: IC100.5 29.73,81.42 v29.67,81.79
A3
  Bottom 0.305: R114.2 22.96,20.2 23.24,20.2 25.1,22.05 25.1,58.93 31.03,64.87 IC100.18
A3'  (via drill 0.3)
  Top 0.305: v30.38,80.01 30.38,81.99 28.58,83.79 28.58,86.1 28.57,86.11 28.57,90.07 28.28,90.37 IC2.64
  Bottom 0.305: IC100.6 v30.38,80.01
A4
  Bottom 0.305: R113.2 23.16,18.29 25.71,20.83 25.71,58.63 31.68,64.6 IC100.17
A4'  (via drill 0.3)
  Top 0.305: v31.03,80.58 31.03,82.25 29.08,84.2 29.08,90.35 28.78,90.66 IC2.63
  Bottom 0.305: IC100.7 v31.03,80.58
A5
  Bottom 0.305: R112.2 23.22,16.51 26.31,19.61 26.31,58.32 32.33,64.34 IC100.16
A5'  (via drill 0.3)
  Top 0.305: v31.68,81.15 31.68,82.52 29.78,84.42 IC2.61
  Bottom 0.305: IC100.8 v31.68,81.15
A6
  Bottom 0.305: R111.2 23.27,14.73 26.92,18.39 26.92,58.02 32.98,64.08 IC100.15
A6'  (via drill 0.3)
  Top 0.305: v32.33,81.71 32.33,82.78 30.28,84.84 IC2.60
  Bottom 0.305: IC100.9 v32.33,81.71
A7
  Bottom 0.305: R110.2 23.32,12.96 27.53,17.17 27.53,57.71 33.63,63.81 IC100.14
A7'  (via drill 0.3)
  Top 0.305: v32.98,80 32.98,83.05 30.78,85.25 IC2.59
  Bottom 0.305: IC100.10 v32.98,80
A8  (via drill 0.3)
  Top 0.305: v34.24,81.18 33.63,81.79 33.63,83.31 32.28,84.67 IC2.56
  Bottom 0.305: R109.2 23.37,11.18 28.14,15.95 28.14,57.41 37.59,66.86 37.59,77.83 v34.24,81.18
A9  (via drill 0.3)
  Top 0.305: v34.24,82.1 34.24,83.62 32.78,85.08 IC2.55
  Bottom 0.305: R108.2 23.42,9.4 28.75,14.73 28.75,57.1 38.2,66.55 38.2,78.13 v34.24,82.1
A10  (via drill 0.3)
  Top 0.305: v34.85,82.7 34.85,83.92 33.28,85.49 IC2.54
  Bottom 0.305: R106.2 23.47,7.62 29.36,13.52 29.36,56.8 38.81,66.25 38.81,78.74 v34.85,82.7
A11  (via drill 0.3)
  Top 0.305: v34.85,89.41 33.78,90.48 IC2.53
  Bottom 0.305: R104.2 23.52,5.84 29.97,12.3 29.97,56.49 39.42,65.94 39.42,79.66 35.46,83.62 35.46,88.8 v34.85,89.41
A12  (via drill 0.3)
  Top 0.305: IC2.52 34.28,91.2 v34.85,90.63
  Bottom 0.305: R102.2 23.27,4.07 30.58,11.38 30.58,56.19 40.03,65.64 40.03,74.17 42.77,76.91 42.77,80.88 36.37,87.28 36.37,89.11 v34.85,90.63
A13  (via drill 0.3)
  Top 0.305: IC2.40 38.97,85.61 v39.12,85.75
  Bottom 0.305: R100.1 34.49,2.29 31.19,5.59 31.19,55.88 40.64,65.33 40.64,73.87 43.38,76.61 43.38,82.1 40.64,84.23 v39.12,85.75
A14  (via drill 0.3)
  Top 0.305: IC2.41 38.25,86.11 v38.51,86.36
  Bottom 0.305: R101.1 34.85,4.07 31.8,7.11 31.8,55.58 41.25,65.03 41.25,73.56 43.99,76.3 43.99,82.4 41.25,84.84 39.73,86.36 v38.51,86.36
A15  (via drill 0.3)
  Top 0.305: v39.12,87.28 38.51,87.28 37.84,86.61 IC2.42
  Bottom 0.305: R103.1 34.59,5.84 32.41,8.03 32.41,55.27 41.86,64.72 41.86,73.26 44.6,76 44.6,82.7 44.3,83.01 41.86,85.14 39.73,87.28 v39.12,87.28
AEC  (via drill 0.3)
  Top 0.305: v18.09,77.68 18.09,79.05 19.15,80.11 IC2.97
  Bottom 0.305: R121.2 14.66,50.17 11.99,52.83 11.99,63.2 17.48,68.68 17.48,76.91 v18.09,77.68
AUX0
  Top 0.305: IC1.21 7.57,85.6 7.11,85.14 7.11,68.68 4.98,66.55 4.98,60.15 2.03,57.2 AUX8.MP
AUX0'
  Top 0.305: IC1.3 16.14,84.95 16.98,84.11 IC2.89
AUX1
  Top 0.305: IC1.20 7.3,86.25 6.5,85.45 6.5,68.99 4.37,66.86 4.37,62.79 AUX7.MP
AUX1'
  Top 0.305: IC1.4 15.19,85.6 15.2,85.61 IC2.86
AUX2
  Top 0.305: IC1.19 7.04,86.9 5.89,85.75 5.89,69.4 AUX6.MP
AUX2'
  Top 0.305: IC1.5 15.15,86.25 15.29,86.11 IC2.85
AUX3
  Top 0.305: IC1.18 6.78,87.55 5.28,86.06 5.28,73.87 AUX5.MP
AUX3'
  Top 0.305: IC1.6 15.88,86.9 16.59,87.61 IC2.82
AUX4
  Top 0.305: IC1.17 6.51,88.2 4.67,86.36 4.67,78.34 AUX4.MP
AUX4'
  Top 0.305: IC1.7 15.62,87.55 16.18,88.11 IC2.81
AUX5
  Top 0.305: IC1.16 6.25,88.85 4.06,86.67 4.06,82.81 AUX3.MP
AUX5'
  Top 0.305: IC1.8 15.35,88.2 16.26,89.11 IC2.79
AUX6
  Top 0.305: IC1.15 5.68,89.5 AUX2.MP
AUX6'
  Top 0.305: IC1.9 15.09,88.85 15.85,89.61 IC2.78
AUX7
  Top 0.305: IC1.14 2.81,90.15 AUX1.MP
AUX7'
  Top 0.305: IC1.10 14.82,89.5 15.43,90.11 IC2.77
AUX-DIR
  Top 0.305: IC1.2 15.88,84.3 16.57,83.61 IC2.90
BA  (via drill 0.3)
  Top 0.305: IC2.95 19.38,81.11 v19.15,81.33
  Bottom 0.305: R120.2 14.91,48.39 11.38,51.92 11.38,63.5 16.87,68.99 16.87,79.05 v19.15,81.33
DIR1  (via drill 0.3)
  Top 0.305: IC2.87 22.35,85.14 22.62,85.41 23.27,85.41 27.78,80.59 v27.86,79.94
  Bottom 0.305: IC100.2 v27.86,79.94
DIR2
  Top 0.305: IC5.2 45.6,73.41 47.42,75.24 47.42,82.93 45.24,85.11 IC2.39
GND  (via drill 0.3)
  Top 0.305: IC2.69 v25.78,88.55 | IC2.62 v29.28,94.08 v29.29,94.08 | IC2.44 34.82,87.61 v34.24,88.19 | IC2.31 35.39,81.11 34.85,80.27 34.24,80.27 33.93,79.96 33.93,79.35 35.46,77.83 35.46,77.22 37.29,75.39 37.9,75.39 | v19,86.82 19.46,86.82 19.67,86.61 IC2.84 | IC2.21 32.78,74.72 32.93,74.72 34.24,73.41 34.24,72.65 v34.85,72.04 | IC4.13 28.43,64.4 28.6,64.57 33.48,64.57 v34.34,65.48
  Bottom 0.305: C104.2 18.63,86.6 v19,86.82 | v34.85,72.04 34.85,71.73 34.79,72.19 IC100.12 | C105.2 33.32,87.28 v34.24,88.19 | IC100.13 34.28,65.53 v34.34,65.48
  other vias: 12.6,90.02 8.94,92.46 14.12,92.46 21.44,92.15 17.17,93.07 31.5,87.89 24.41,95.3 32.03,95.3 32.03,97.13 30.2,97.13 24.41,97.13 34.77,75.03 36.6,69.09 27.76,70.92 18.31,76.41 45.14,87.38 46.96,84.64 46.96,50.19 36.91,55.37 36.91,50.19 6.43,65.74 6.43,63.3 13.74,77.47 12.47,69.75 36.3,77.02 16.64,82.35 15.72,81.43 19.99,77.93 36.22,91.39 22.96,84.69 44.07,68.33 17.25,62.38 15.27,62.69 19.53,60.4 9.93,65.43 45.9,64.82 14.5,74.42
  pour Bottom (isolate 0.305): 48.26,45.21 arc-90 47.75,44.71 41.3,44.71 arc90 40.28,43.69 40.28,1.02 arc-90 39.62,0.51 18.29,0.51 arc-90 17.78,1.02 17.78,38.61 arc90 16.76,39.63 1.02,39.63 arc-90 0.51,40.13 0.51,97.33 arc-90 1.23,97.54 47.75,97.54 arc-90 48.26,97.03
  pour Top (isolate 0.305): 48.26,45.21 arc-90 47.75,44.71 41.3,44.71 arc90 40.28,43.69 40.28,1.02 arc-90 39.62,0.51 18.29,0.51 arc-90 17.78,1.02 17.78,38.61 arc90 16.76,39.63 1.02,39.63 arc-90 0.51,40.13 0.51,97.33 arc-90 1.23,97.54 47.75,97.54 arc-90 48.26,97.03
IO'
  Top 0.305: IC4.3 34.28,70.25 37.29,72.8 37.29,74.32 35.66,75.8 IC2.25
MA0
  Top 0.305: R9.1 43.66,47.63 44.91,48.87 44.91,61.06 43.65,62.32 IC5.20
MA0'
  Top 0.305: IC5.4 44.3,73.87 46.13,75.69 46.13,81.79 44.31,83.61 IC2.36
MA1
  Top 0.305: R6.1 42.29,52.96 43.08,53.75 43.08,60.15 41.7,61.53 IC5.17
MA1'
  Top 0.305: IC5.7 42.35,74.66 44.3,76.61 44.3,79.96 42.65,81.61 IC2.32
MA2
  Top 0.305: R8.1 42.7,49.41 44.3,51.01 44.3,60.76 43,62.06 IC5.19
MA2'
  Top 0.305: IC5.5 43.65,74.13 45.52,76 45.52,81.18 43.59,83.11 IC2.35
MA3
  Top 0.305: R11.1 44.14,45.98 45.52,47.35 45.52,61.37 44.3,62.59 IC5.21
MA3'
  Top 0.305: IC5.3 44.95,73.6 46.74,75.39 46.74,82.4 45.03,84.11 IC2.37
MA4
  Top 0.305: R7.1 42.65,51.18 43.69,52.22 43.69,60.45 42.35,61.8 IC5.18
MA4'
  Top 0.305: IC5.6 43,74.39 44.91,76.3 44.91,80.57 43.37,82.11 IC2.33
MA5
  Top 0.305: R5.1 41.86,54.74 41.86,60.45 41.05,61.27 IC5.16
MA5'
  Top 0.305: IC5.8 41.7,74.92 43.69,76.91 43.69,79.66 42.73,80.61 IC2.30
MA6
  Top 0.305: R12.1 36.53,48.1 36.07,48.57 36.07,57.41 39.75,61.09 IC5.14
MA6'
  Top 0.305: IC5.10 40.4,75.45 42.47,77.52 42.47,79.05 41.91,79.61 IC2.28
MA7
  Top 0.305: IC5.15 40.4,58.38 R4.1
MA7'
  Top 0.305: IC5.9 41.05,75.19 43.08,77.22 43.08,79.35 42.32,80.11 IC2.29
N$1
  Top 0.305: IC2.96 16.26,80.61 | MISC2.MP 16.12,80.61 16.26,80.61 | 16.26,80.61 R1.1
N$2  (via drill 0.3)
  Top 0.305: IC2.58 31.28,90.54 v31.5,90.32
  Bottom 0.305: MISC1.MP 36.47,92.56 36.07,92.15 33.32,92.15 v31.5,90.32
N$3
  Top 0.305: IC2.27 39.74,79.11 MISC3.MP
N$4
  Top 0.305: R1.2 15.31,77.03 LED1.A
N$22
  Top 0.305: IC2.22 33.28,75.28 34.7,73.87 35.76,73.87 CLK.MP
N$26
  Top 0.305: PLA-SOCKET.17 R20.2
N$27
  Top 0.305: PLA-SOCKET.31 39.17,55.63 40.03,56.49 40.71,56.49 R4.2
N$28
  Top 0.305: R5.2 40.11,54.74 39.42,54.05 38.77,54.05 PLA-SOCKET.30
N$29
  Top 0.305: PLA-SOCKET.15 R23.2
N$30
  Top 0.305: PLA-SOCKET.29 38.96,52.07 39.73,52.83 40.58,52.83 R6.2
N$31
  Top 0.305: PLA-SOCKET.28 39.32,50.29 40.03,51.01 40.53,51.01 R7.2
N$32
  Top 0.305: PLA-SOCKET.27 39.37,48.52 40.03,49.18 40.48,49.18 R8.2
N$33
  Top 0.305: PLA-SOCKET.26 39.42,46.74 40.03,47.35 40.43,47.35 R9.2
N$34
  Top 0.305: PLA-SOCKET.25 39.69,44.96 R11.2
N$35
  Top 0.305: PLA-SOCKET.24 38.4,43.18 36.98,44.6 36.98,44.88 R12.2
N$36
  Top 0.305: PLA-SOCKET.23 36.87,41.4 R13.2
N$37
  Top 0.305: PLA-SOCKET.22 R15.2
N$38
  Top 0.305: PLA-SOCKET.14 R24.2
N$39
  Top 0.305: PLA-SOCKET.13 R25.2
N$40
  Top 0.305: PLA-SOCKET.12 R26.2
N$41
  Top 0.305: PLA-SOCKET.11 R27.2
N$42
  Top 0.305: PLA-SOCKET.10 R28.2
N$43
  Top 0.305: PLA-SOCKET.9 R29.2
N$44
  Top 0.305: PLA-SOCKET.8 R30.2
N$45
  Top 0.305: PLA-SOCKET.7 R31.2
N$46
  Top 0.305: PLA-SOCKET.6 R32.2
N$47
  Bottom 0.305: PLA-SOCKET.5 R107.2
N$48
  Bottom 0.305: PLA-SOCKET.4 R105.2
N$49
  Bottom 0.305: PLA-SOCKET.3 R103.2
N$50
  Bottom 0.305: PLA-SOCKET.2 R101.2
N$51
  Bottom 0.305: PLA-SOCKET.1 R100.2
N$52
  Bottom 0.305: PLA-SOCKET.63 R102.1
N$53
  Bottom 0.305: PLA-SOCKET.62 R104.1
N$54
  Bottom 0.305: PLA-SOCKET.61 R106.1
N$55
  Bottom 0.305: PLA-SOCKET.60 R108.1
N$56
  Bottom 0.305: PLA-SOCKET.59 R109.1
N$57
  Bottom 0.305: PLA-SOCKET.58 R110.1
N$58
  Bottom 0.305: PLA-SOCKET.57 R111.1
N$59
  Bottom 0.305: PLA-SOCKET.56 R112.1
N$60
  Bottom 0.305: PLA-SOCKET.55 R113.1
N$61
  Bottom 0.305: PLA-SOCKET.54 R114.1
N$62
  Bottom 0.305: PLA-SOCKET.53 R115.1
N$63
  Bottom 0.305: PLA-SOCKET.52 R116.1
N$64
  Bottom 0.305: R117.1 19.53,25.39 PLA-SOCKET.51
N$65
  Top 0.305: PLA-SOCKET.50 20.17,27.18 20.83,27.84 21.22,27.84 R22.1
N$66
  Top 0.305: PLA-SOCKET.49 20.12,28.96 20.83,29.67 21.27,29.67 R21.1
N$67
  Top 0.305: PLA-SOCKET.47 R19.1
N$68
  Top 0.305: PLA-SOCKET.46 R18.1
N$69
  Top 0.305: PLA-SOCKET.45 R17.1
N$70
  Top 0.305: PLA-SOCKET.44 R16.1
N$71
  Top 0.305: R14.1 17.2,41.23 18.69,39.73 19.41,39.73 PLA-SOCKET.43
N$72
  Bottom 0.305: PLA-SOCKET.42 18.92,41.4 17.27,43.06 R118.1
N$73
  Bottom 0.305: PLA-SOCKET.41 18.92,43.18 17.27,44.83 R119.1
N$74
  Top 0.305: R10.1 16.78,46.52 18.39,44.91 19.46,44.91 PLA-SOCKET.40
N$75
  Bottom 0.305: PLA-SOCKET.39 18.92,46.74 17.27,48.39 R120.1
N$76
  Bottom 0.305: PLA-SOCKET.38 18.92,48.52 17.27,50.17 R121.1
N$77
  Bottom 0.305: PLA-SOCKET.37 18.92,50.29 17.27,51.95 R122.1
N$78
  Bottom 0.305: PLA-SOCKET.36 18.92,52.07 17.27,53.72 R123.1
N$79
  Bottom 0.305: PLA-SOCKET.35 18.92,53.85 17.27,55.5 R124.1
N$80
  Bottom 0.305: PLA-SOCKET.34 18.92,55.63 17.27,57.28 R125.1
NMI
  Top 0.305: R30.1 30.89,14.73 29.36,16.26 29.36,56.49 23.06,62.79 IC3.21
NMI'
  Top 0.305: IC3.3 23.71,70.65 23.88,70.82 25.71,70.82 28.28,73.39 IC2.12
PHI0  (via drill 0.3)
  Top 0.305: v18.39,73.71 18.39,74.17 22.66,78.44 v23.88,78.44 | IC2.23 33.78,78.29 33.63,78.44 v25.1,78.44
  Bottom 0.305: R122.2 14.71,51.95 12.6,54.05 12.6,62.89 18.09,68.38 18.09,73.26 v18.39,73.71 | v23.88,78.44 v25.1,78.44
R/_W  (via drill 0.3)
  Top 0.305: IC2.49 38.29,90.11 39.12,90.93 40.03,90.93 41.55,89.41 v41.55,88.19
  Bottom 0.305: R105.1 34.65,7.62 33.02,9.25 33.02,54.97 42.47,64.42 42.47,72.95 45.21,75.69 45.21,83.92 42.47,86.36 41.55,87.28 v41.55,88.19
RAMR/_W
  Top 0.305: R13.1 36.38,43.07 35.46,44 35.46,59.54 32.98,62.02 IC4.20
RAMR/_W'
  Top 0.305: IC4.4 33.63,72.95 32.28,74.3 IC2.20
RESTORE  (via drill 0.3)
  Top 0.305: R29.1 30.63,16.51 29.97,17.17 29.97,56.8 25.4,61.37 v25.4,62.89 | v25.4,85.14 25.4,87.89 25.1,88.19 25.1,89.11 25.28,89.29 IC2.70
  Bottom 0.305: v25.4,85.14 25.4,79.89 26.24,79.2 26.24,77.68 25.4,76.91 v25.4,62.89
TCK  (via drill 0.3)
  Top 0.305: 39.12,89.72 v39.42,90.02 39.01,89.61 IC2.48
  Bottom 0.305: TCK.MP 19.71,96.01 22.66,93.07 35.76,93.07 36.98,94.29 38.2,94.29 40.34,92.15 40.34,90.93 v39.42,90.02
TDI  (via drill 0.3)
  Top 0.305: v40.34,88.19 38.81,88.19 38.73,88.11 IC2.45
  Bottom 0.305: TDI.MP 38.91,96.01 41.55,93.37 41.55,89.41 v40.34,88.19
TDO  (via drill 0.3)
  Top 0.305: v22.66,86.21 22.66,86.67 22.21,87.11 IC2.83
  Bottom 0.305: TDO.MP 12.7,96.01 v22.66,86.21
TMS  (via drill 0.3)
  Top 0.305: v40.03,89.11 IC2.47
  Bottom 0.305: TMS.MP 24.89,96.01 26.62,94.29 28.45,94.29 29.06,94.9 30.28,94.9 30.89,94.29 35.15,94.29 36.07,95.2 38.51,95.2 40.95,92.76 40.95,90.02 v40.03,89.11
VA6  (via drill 0.3)
  Top 0.305: IC2.93 19.32,82.11 v18.69,82.1
  Bottom 0.305: R119.2 15.42,44.83 10.77,49.48 10.77,63.81 16.26,69.29 16.26,79.66 v18.69,82.1
VA7  (via drill 0.3)
  Top 0.305: 22.35,82.7 v22.66,82.7 22.56,82.61 IC2.92
  Bottom 0.305: R118.2 14.15,43.06 10.16,47.04 10.16,64.11 15.65,69.6 15.65,80.27 18.39,83.01 22.35,83.01 v22.66,82.7

### Text on the board
tNames: +3V3 | GND | JTAG | http://www.frank-buss.de/c64/pla/index.html | REV A | 2012 | GND